# Altium schematic sheet Power Supply Noise Canceller.SchDoc
size A
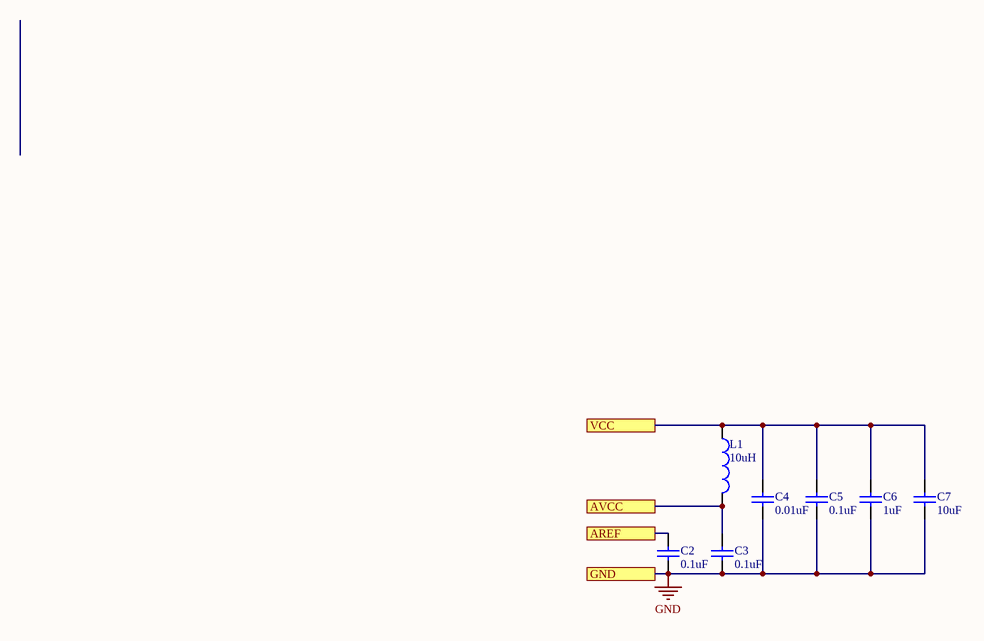
[diagram p0: Power Supply Noise Canceller.SchDoc]

## Parts
C2  0.1uF  [CAPC2013X94X50LL20T25]
C3  0.1uF  [CAPC2013X94X50LL20T25]
C4  0.01uF  [CAPC2013X88X50LL20T25]
C5  0.1uF  [CAPC2013X94X50LL20T25]
C6  1uF  [CAPC2013X145X50ML20T25]
C7  10uF  [CAPC2013X145X50LL20T20]
L1  10uH  [TDK-IND0805-125_V]

## Ports
AREF, AVCC, GND, VCC

## Nets
GND: C2.1 C3.1 C4.1 C5.1 C6.1 C7.1 ; port GND
AREF: C2.2 ; port AREF
AVCC: C3.2 L1.2 ; port AVCC
VCC: C4.2 C5.2 C6.2 C7.2 L1.1 ; port VCC

## Library data of the parts
C2 C3 C5 = CMP-2000-05808-1: Chip Capacitor, 0.1 uF, +/- 5%, 50 V, -55 to 125 degC, 0805 (2012 Metric), RoHS, Tape and Reel; Case Width: 1.25mm; Case Length: 2.01mm; Case Height: 0.94mm; Brand: AVX; Type: StandardX7RMLCCs; Capacitance - nF: 100nF; Dissipation Factor DF: 2.5; Voltage Rating DC: 50V; Temperature Coefficient / Code: +/-15%; Capacitance - pF: 100000pF; Dielectric: X7R; Dimensions: 1.25mmWx2.01mmLx0.94mmH; Product: GeneralTypeMLCCs; Package Description: 2-Pin Surface Mount Device, Body 2.01 x 1.25 mm; Capacitance: 0.1uF; Package / Case: 0805(2012metric); Product Category: MultilayerCeramicCapacitorsMLCC-SMD/SMT; Case Code - mm: 2012; Packaging: Reel; Manufacturer URL: http://www.avx.com/; Operating Temperature Range: -55Cto+125C; Termination Style: SMD/SMT; Maximum Operating Temperature: +125C; Case Code - in: 0805; Minimum Operating Temperature: -55C; Factory Pack Quantity: 4000; RoHS: Details; Voltage Rating: 50V; Tolerance: 5%; Package Reference: 0805; Datasheet URL: http://www.farnell.com/datasheets/1679506.pdf; Manufacturer: AVX; Mounting Technology: SurfaceMount; Datasheet Version: 11/2012
C4 = CMP-2000-05989-1: Chip Capacitor, 0.01 uF, +/- 10%, 50 V, -55 to 125 degC, 0805 (2012 Metric), RoHS, Tape and Reel; Manufacturer: Kemet; Voltage Rating: 50V; Dissipation Factor DF: 2.5; Type: SMDMLCCX7R6.3-250VDCCommericalGrade; Class: Class1; Capacitance - nF: 10nF; Dielectric: X7R; Case Width: 1.2mm; Case Length: 2mm; Temperature Coefficient / Code: +/-15%; Capacitance - pF: 10000pF; Case Height: 0.78mm; Datasheet Version: 10/2016; Dimensions: 1.2mmWx2mmLx0.78mmH; Case Code - mm: 2012; Datasheet URL: http://capacitoredge.kemet.com/capedge2/DataSheet/Datasheet-C0805C103K5RAC.pdf?pn=C0805C103K5RAC{BULK}; Capacitance: 0.01uF; Minimum Operating Temperature: -55C; Package / Case: 0805(2012metric); Mounting Technology: SurfaceMount; Package Reference: 0805; Product Category: MultilayerCeramicCapacitorsMLCC-SMD/SMT; Packaging: Reel; Brand: Kemet; Factory Pack Quantity: 4000; Voltage Rating DC: 50V; Operating Temperature Range: -55Cto+125C; Product: GeneralTypeMLCCs; RoHS: Details; Package Description: 2-Pin Surface Mount Device, Body 2 x 1.25 mm; Maximum Operating Temperature: +125C; Termination Style: SMD/SMT; Manufacturer URL: http://www.kemet.com/; Lead Spacing: 0.75mm; Case Code - in: 0805; Series: C0805C; Tolerance: 10%
C6 = CMP-2100-03605-1: Chip Capacitor, 1 uF, 25 V, 10%, -55 to 125 degC, 0805 (2012 Metric), RoHS, Tape and Reel; Manufacturer: Yageo; Voltage Rating: 25V; Dissipation Factor: 5%; Dielectric: X7R; Capacitance: 1uF; Length: 2mm; REACH SVHC: NoSVHC; Package Reference: 0805; Lead Free: LeadFree; Datasheet Version: Rev. 15, 10/2016; Width: 0.049inch; Thickness: 0.057inch; Case Code (Metric): 2012; Tolerance: 10%; Datasheet URL: http://www.yageo.com/documents/recent/UPY-GPHC_X7R_6.3V-to-50V_15.pdf; Number of Pins: 2; Radiation Hardening: No; Max Operating Temperature: 125degC; Depth: 1.25mm; Composition: Ceramic; Case Code (Imperial): 0805; Manufacturer URL: http://www.yageo.com/; Case/Package: 0805; Min Operating Temperature: -55degC; Mount: SurfaceMount; Package Description: 2-Pin Surface Mount Device, Body 2 x 1.25 mm; Height: 1.25mm; Termination: SMD/SMT; Packaging: TapeandReel; RoHSCompliant: True; Package Quantity: 3000; Voltage Rating (DC): 25V
C7 = CMP-2000-07390-1: Chip Capacitor, 10 uF, +/- 10%, 10 V, -55 to 85 degC, 0805 (2012 Metric), RoHS, Tape and Reel; Manufacturer: Vishay; Unit Weight: 0.000194oz; Voltage Rating DC: 10VDC; Brand: Vishay/Vitramon; Dielectric: X5R; Series: VJW1BC; Mounting Technology: SurfaceMount; Case Code - in: 0805; Capacitance: 10uF; Package Description: 2-Pin Surface Mount Device, Body 2.00 x 1.25 mm; Case Code - mm: 2012; Length: 2mm; Datasheet Version: 07/2016; Manufacturer URL: http://www.vishay.com/; Product Category: MultilayerCeramicCapacitorsMLCC-SMD/SMT; Maximum Operating Temperature: +85C; Datasheet URL: http://www.vishay.com/docs/28548/vjw1bcbascomseries.pdf; Factory Pack Quantity: 3000; Termination Style: SMD/SMT; Package / Case: 0805(2012metric); Minimum Operating Temperature: -55C; Package Reference: 0805; RoHS: True; Width: 1.25mm; Height: 1.25mm; Tolerance: 10%; Packaging: Reel
L1 = CMP-0266-00001-1: Multilayer Inductor, 10 uH, ±20%, 300 mOhm, 50MHz, 0805(2012); PartNumber: MLZ2012N100LT; DC Resistance: 0.3 Ohm; PackageReference: IND0805-125; ComponentLink1URL: http://www.global.tdk.com/; DatasheetVersion: 05/2013; ComponentLink2Description: Datasheet; ComponentLink1Description: Manufacturer URL; Mounting Technology: Suface Mount; ComponentLink2URL: http://www.tdk.co.jp/tcfx01/c533_mlz.pdf; PackageDescription: 2-Pin SMT Inductor, 2 x 1.25 mm Body